# EAGLE design DIN3X (EAGLE 5.06)
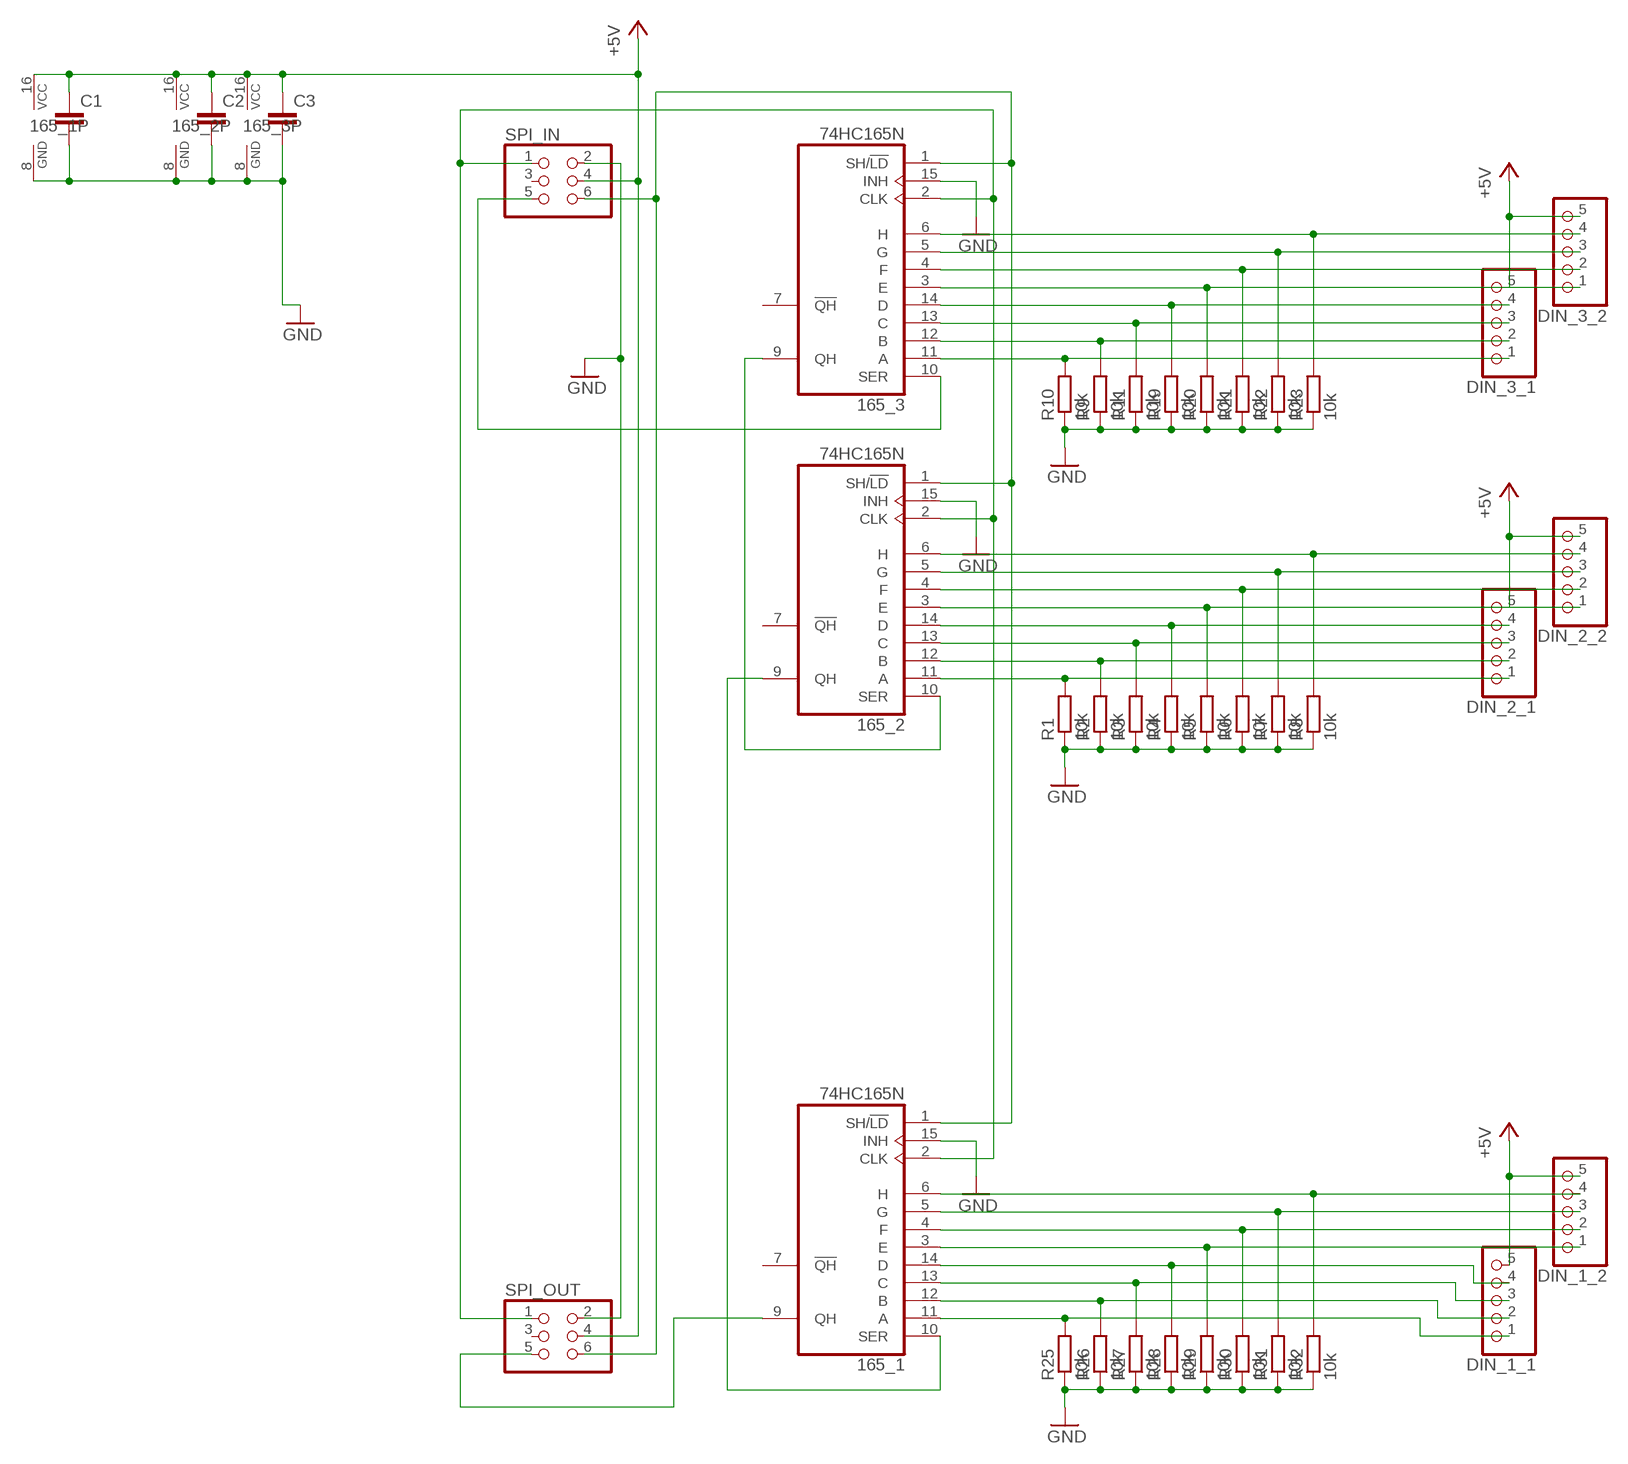
[diagram p0: schematic, sheet 1]

## Parts
165_1  74HC165N  [DIL16]
165_2  74HC165N  [DIL16]
165_3  74HC165N  [DIL16]
C1  C-EU050-024X044  [C050-024X044]
C2  C-EU050-024X044  [C050-024X044]
C3  C-EU050-024X044  [C050-024X044]
DIN_1_1  PINHD-1X5  [1X05]
DIN_1_2  PINHD-1X5  [1X05]
DIN_2_1  PINHD-1X5  [1X05]
DIN_2_2  PINHD-1X5  [1X05]
DIN_3_1  PINHD-1X5  [1X05]
DIN_3_2  PINHD-1X5  [1X05]
R1  10k  R-EU_0207/10  [0207/10]
R2  10k  R-EU_0207/10  [0207/10]
R3  10k  R-EU_0207/10  [0207/10]
R4  10k  R-EU_0207/10  [0207/10]
R5  10k  R-EU_0207/10  [0207/10]
R6  10k  R-EU_0207/10  [0207/10]
R7  10k  R-EU_0207/10  [0207/10]
R8  10k  R-EU_0207/10  [0207/10]
R9  10k  R-EU_0207/10  [0207/10]
R10  10k  R-EU_0207/10  [0207/10]
R11  10k  R-EU_0207/10  [0207/10]
R19  10k  R-EU_0207/10  [0207/10]
R20  10k  R-EU_0207/10  [0207/10]
R21  10k  R-EU_0207/10  [0207/10]
R22  10k  R-EU_0207/10  [0207/10]
R23  10k  R-EU_0207/10  [0207/10]
R25  10k  R-EU_0207/10  [0207/10]
R26  10k  R-EU_0207/10  [0207/10]
R27  10k  R-EU_0207/10  [0207/10]
R28  10k  R-EU_0207/10  [0207/10]
R29  10k  R-EU_0207/10  [0207/10]
R30  10k  R-EU_0207/10  [0207/10]
R31  10k  R-EU_0207/10  [0207/10]
R32  10k  R-EU_0207/10  [0207/10]
SPI_IN  PINHD-2X3  [2X03]
SPI_OUT  PINHD-2X3  [2X03]

## Nets
+5V: 165_1.16(VCC) 165_2.16(VCC) 165_3.16(VCC) C1.1 C2.1 C3.1 DIN_1_1.5 DIN_1_2.5 DIN_2_1.5 DIN_2_2.5 DIN_3_1.5 DIN_3_2.5 SPI_IN.4 SPI_OUT.4
D0: 165_3.11(A) DIN_3_1.1 R10.2
D1: 165_3.12(B) DIN_3_1.2 R9.2
D2: 165_3.13(C) DIN_3_1.3 R11.2
D3: 165_3.14(D) DIN_3_1.4 R19.2
D4: 165_3.3(E) DIN_3_2.1 R20.2
D5: 165_3.4(F) DIN_3_2.2 R21.2
D6: 165_3.5(G) DIN_3_2.3 R22.2
D7: 165_3.6(H) DIN_3_2.4 R23.2
D8: 165_2.6(H) DIN_2_2.4 R8.2
D9: 165_2.5(G) DIN_2_2.3 R7.2
D10: 165_2.4(F) DIN_2_2.2 R6.2
D11: 165_2.3(E) DIN_2_2.1 R5.2
D12: 165_2.14(D) DIN_2_1.4 R4.2
D13: 165_2.13(C) DIN_2_1.3 R3.2
D14: 165_2.12(B) DIN_2_1.2 R2.2
D15: 165_2.11(A) DIN_2_1.1 R1.2
D24: 165_1.6(H) DIN_1_2.4 R32.2
D25: 165_1.5(G) DIN_1_2.3 R31.2
D26: 165_1.4(F) DIN_1_2.2 R30.2
D27: 165_1.3(E) DIN_1_2.1 R29.2
D28: 165_1.14(D) DIN_1_1.4 R28.2
D29: 165_1.13(C) DIN_1_1.3 R27.2
D30: 165_1.12(B) DIN_1_1.2 R26.2
D31: 165_1.11(A) DIN_1_1.1 R25.2
GND: 165_1.8(GND) 165_1.15(INH) 165_2.8(GND) 165_2.15(INH) 165_3.8(GND) 165_3.15(INH) C1.2 C2.2 C3.2 R1.1 R2.1 R3.1 R4.1 R5.1 R6.1 R7.1 R8.1 R9.1 R10.1 R11.1 R19.1 R20.1 R21.1 R22.1 R23.1 R25.1 R26.1 R27.1 R28.1 R29.1 R30.1 R31.1 R32.1 SPI_IN.2 SPI_OUT.2
N$3: 165_1.10(SER) 165_2.9(QH)
N$4: 165_3.10(SER) SPI_IN.5
N$5: 165_1.9(QH) SPI_OUT.5
N$30: 165_1.1(SH/!LD) 165_2.1(SH/!LD) 165_3.1(SH/!LD) SPI_IN.6 SPI_OUT.6
N$33: 165_2.10(SER) 165_3.9(QH)
N$82: 165_1.2(CLK) 165_2.2(CLK) 165_3.2(CLK) SPI_IN.1 SPI_OUT.1
Unconnected: 165_1.7(!QH) 165_2.7(!QH) 165_3.7(!QH) SPI_IN.3 SPI_OUT.3

## Library data of the parts
165_1-165_3 = 74xx-eu:74*165: 8-bit parallel load SHIFT REGISTER
C1-C3 = rcl:C-EU: CAPACITOR, European symbol
DIN_1_1 DIN_1_2 DIN_2_1 DIN_2_2 DIN_3_1 DIN_3_2 = pinhead:PINHD-1X5: PIN HEADER
R1-R11 R19-R23 R25-R32 = rcl:R-EU_: RESISTOR, European symbol
SPI_IN SPI_OUT = pinhead:PINHD-2X3: PIN HEADER

## Board
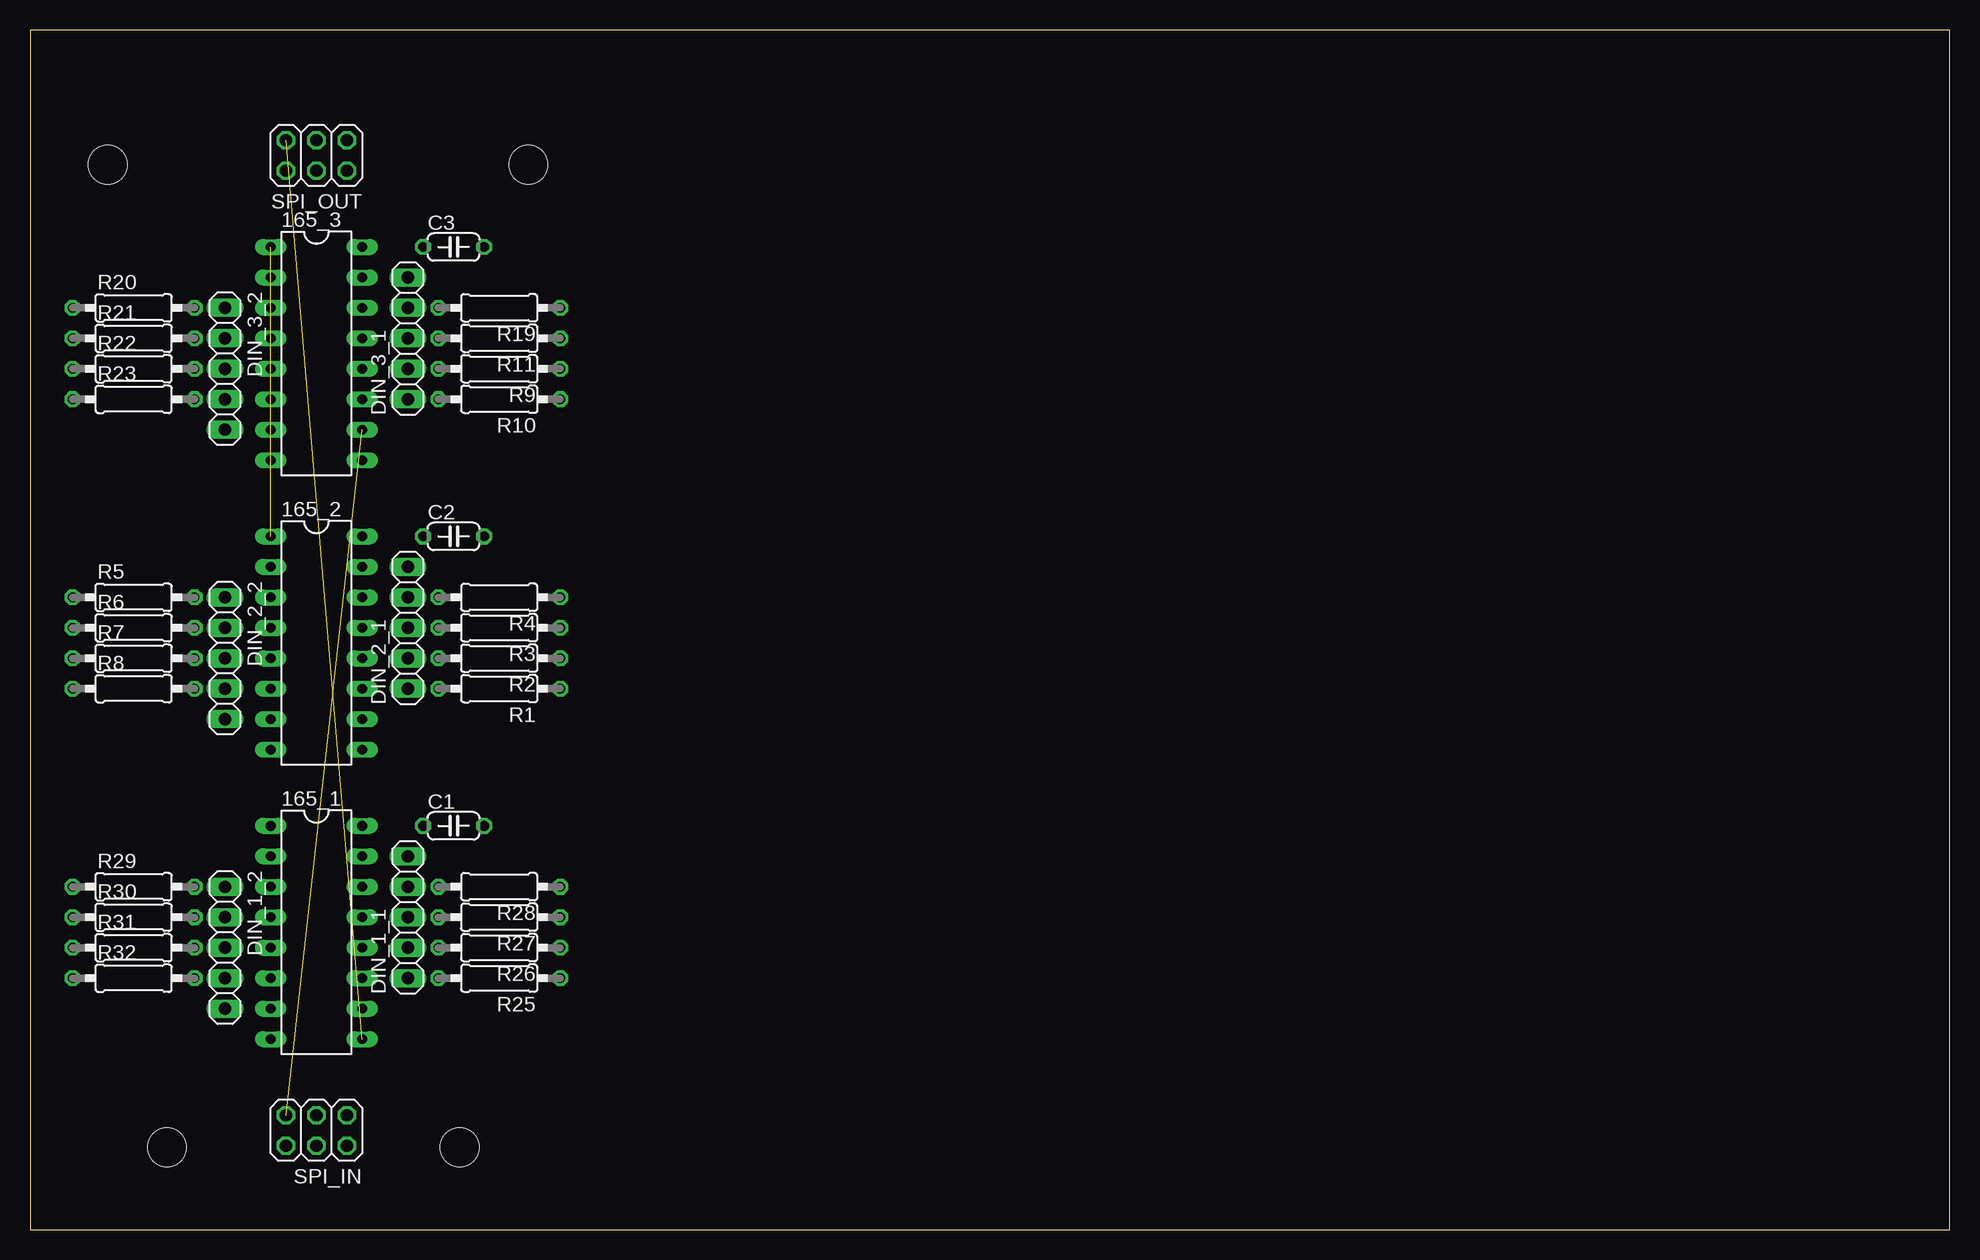
[diagram p1: board, top side]
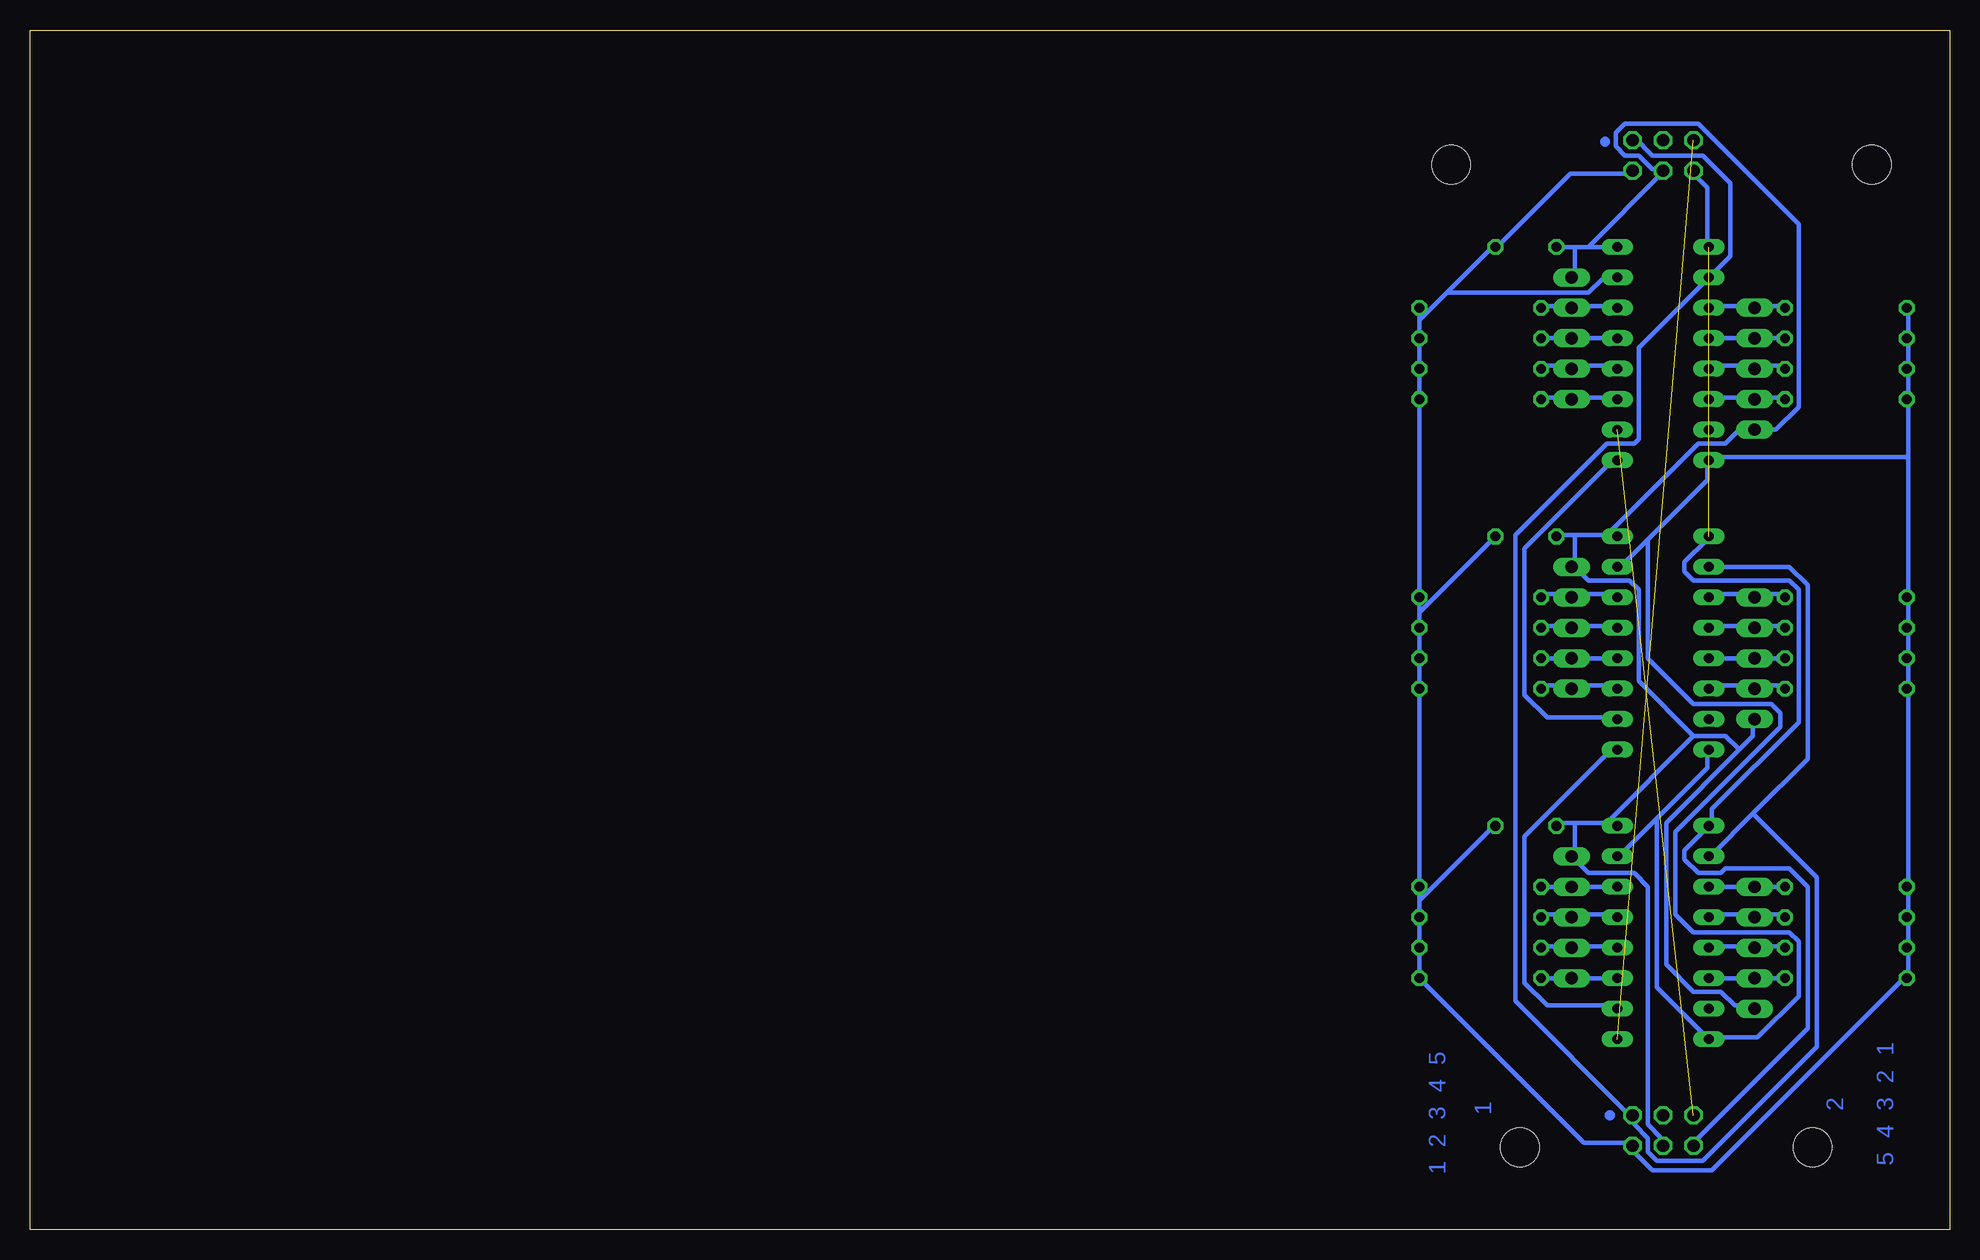
[diagram p2: board, bottom side, seen from below]

Size 160 x 100 mm. Coordinates in mm from the lower left corner, seen from the top.
Outline: 0,0 160,0 160,100 0,100 0,0
Copper layers (1*16): Top 0.018mm / dielectric 1.5mm / Bottom 0.018mm
Design rules "DRC": minimum track width 15mil, minimum drill 20mil, track to track 10mil, track to pad 10mil, pad to pad 10mil, via to via 10mil, smd to smd 8mil, copper to edge 80mil, drill to drill 20mil, minimum pad ring 10mil, minimum via ring 10mil, stop-mask expansion 4mil, vias tented up to drill 0mil, thermal gap 10mil
Holes 3.2 mm at 11.43,6.86 35.81,6.86 41.53,88.77 6.48,88.77

### Footprints (pad centres in the part's own frame; a part is rotated, then mirrored left to right if it is on the bottom)
DIL16 = drill 0.813 long: 1 -8.89,-3.81; 2 -6.35,-3.81; 3 -3.81,-3.81; 4 -1.27,-3.81; 5 1.27,-3.81; 6 3.81,-3.81; 7 6.35,-3.81; 8 8.89,-3.81; 9 8.89,3.81; 10 6.35,3.81; 11 3.81,3.81; 12 1.27,3.81; 13 -1.27,3.81; 14 -3.81,3.81; 15 -6.35,3.81; 16 -8.89,3.81
C050-024X044 = drill 0.813 octagon: 1 -2.54,0; 2 2.54,0
1X05 = drill 1.016 long: 1 -5.08,0; 2 -2.54,0; 3 0,0; 4 2.54,0; 5 5.08,0
0207/10 = drill 0.813 octagon: 1 -5.08,0; 2 5.08,0
2X03 = drill 1.016 octagon: 1 -2.54,-1.27; 2 -2.54,1.27; 3 0,-1.27; 4 0,1.27; 5 2.54,-1.27; 6 2.54,1.27

### Placement (x,y rotation side)
165_1  23.88,24.77 270 top
165_2  23.88,48.9 270 top
165_3  23.88,73.03 270 top
C1  35.31,33.66 0 top
C2  35.31,57.78 0 top
C3  35.31,81.92 0 top
DIN_1_1  31.5,26.04 90 top
DIN_1_2  16.26,23.5 270 top
DIN_2_1  31.5,50.16 90 top
DIN_2_2  16.26,47.62 270 top
DIN_3_1  31.5,74.3 90 top
DIN_3_2  16.26,71.75 270 top
R1  39.12,45.09 180 top
R2  39.12,47.62 180 top
R3  39.12,50.16 180 top
R4  39.12,52.7 180 top
R5  8.64,52.7 0 top
R6  8.64,50.16 0 top
R7  8.64,47.62 0 top
R8  8.64,45.09 0 top
R9  39.12,71.75 180 top
R10  39.12,69.22 180 top
R11  39.12,74.3 180 top
R19  39.12,76.83 180 top
R20  8.64,76.83 0 top
R21  8.64,74.3 0 top
R22  8.64,71.75 0 top
R23  8.64,69.22 0 top
R25  39.12,20.95 180 top
R26  39.12,23.5 180 top
R27  39.12,26.04 180 top
R28  39.12,28.57 180 top
R29  8.64,28.57 0 top
R30  8.64,26.04 0 top
R31  8.64,23.5 0 top
R32  8.64,20.95 0 top
SPI_IN  23.88,8.26 180 top
SPI_OUT  23.88,89.53 180 top

### Tracks (layer width: path | path; a pad name or v marks a point on that pad's centre or on a via)
+5V
  Bottom 0.381: 17.53,40.01 16.38,41.15 16.38,42.29 DIN_2_2.5 | 17.53,40.01 23.62,33.91 23.62,22.1 21.34,19.81 19.05,19.81 17.91,18.67 16.38,18.67 DIN_1_2.5 | 28.57,33.91 27.81,33.91 165_1.16 28.57,33.91 | 31.24,33.91 28.57,33.91 | 31.24,33.91 32.77,33.91 C1.1 | 31.24,33.91 31.24,31.24 DIN_1_1.5 30.1,29.72 26.29,29.72 25.15,28.57 25.15,8.76 24,7.62 24,7.24 SPI_IN.4 | 17.53,40.01 18.67,41.15 21.34,41.15 | 28.57,33.91 21.34,41.15 | 30.1,81.92 31.24,81.92 | 31.24,81.92 C3.1 | 30.1,81.92 165_3.16 | 31.24,81.92 31.24,79.63 DIN_3_1.5 | 30.1,81.92 24,88.01 SPI_OUT.4 24,88.39 24.77,88.39 25.91,89.53 27.05,89.53 27.81,90.3 27.81,91.44 27.05,92.2 20.95,92.2 12.57,83.82 12.57,68.58 14.48,66.67 DIN_3_2.5 17.53,66.67 18.67,65.53 20.95,65.53 28.57,57.91 | 28.57,57.91 27.81,57.91 165_2.16 28.57,57.91 | 31.24,57.91 28.57,57.91 | 31.24,57.91 32.77,57.91 C2.1 | 31.24,55.24 31.24,57.91 | 21.34,41.15 25.91,45.72 25.91,53.34 26.67,54.1 30.1,54.1 31.24,55.24 | 31.24,55.24 DIN_2_1.5
D0
  Bottom 0.381: R10.2 33.91,69.34 31.62,69.34 DIN_3_1.1 31.24,69.34 27.81,69.34 165_3.11
D1
  Bottom 0.381: R9.2 33.91,72.01 31.62,72.01 DIN_3_1.2 31.24,72.01 27.81,72.01 165_3.12
D2
  Bottom 0.381: R11.2 DIN_3_1.3 165_3.13
D3
  Bottom 0.381: R19.2 33.91,76.96 31.62,76.96 DIN_3_1.4 31.24,76.96 27.81,76.96 165_3.14
D4
  Bottom 0.381: 165_3.3 19.81,76.96 16.38,76.96 DIN_3_2.1 16,76.96 13.72,76.96 R20.2
D5
  Bottom 0.381: 165_3.4 DIN_3_2.2 R21.2
D6
  Bottom 0.381: 165_3.5 19.81,72.01 16.38,72.01 DIN_3_2.3 16,72.01 13.72,72.01 R22.2
D7
  Bottom 0.381: 165_3.6 19.81,69.34 16.38,69.34 DIN_3_2.4 16,69.34 13.72,69.34 R23.2
D8
  Bottom 0.381: 165_2.6 19.81,45.34 16.38,45.34 DIN_2_2.4 16,45.34 13.72,45.34 R8.2
D9
  Bottom 0.381: 165_2.5 DIN_2_2.3 R7.2
D10
  Bottom 0.381: 165_2.4 19.81,50.29 16.38,50.29 DIN_2_2.2 16,50.29 13.72,50.29 R6.2
D11
  Bottom 0.381: 165_2.3 19.81,52.96 16.38,52.96 DIN_2_2.1 16,52.96 13.72,52.96 R5.2
D12
  Bottom 0.381: R4.2 33.91,52.96 31.62,52.96 DIN_2_1.4 31.24,52.96 27.81,52.96 165_2.14
D13
  Bottom 0.381: R3.2 33.91,50.29 31.62,50.29 DIN_2_1.3 31.24,50.29 27.81,50.29 165_2.13
D14
  Bottom 0.381: R2.2 DIN_2_1.2 165_2.12
D15
  Bottom 0.381: R1.2 33.91,45.34 31.62,45.34 DIN_2_1.1 31.24,45.34 27.81,45.34 165_2.11
D24
  Bottom 0.381: 165_1.6 DIN_1_2.4 R32.2
D25
  Bottom 0.381: 165_1.5 19.81,23.62 16.38,23.62 DIN_1_2.3 16,23.62 13.72,23.62 R31.2
D26
  Bottom 0.381: 165_1.4 19.81,26.29 16.38,26.29 DIN_1_2.2 16,26.29 13.72,26.29 R30.2
D27
  Bottom 0.381: 165_1.3 DIN_1_2.1 R29.2
D28
  Bottom 0.381: R28.2 DIN_1_1.4 165_1.14
D29
  Bottom 0.381: R27.2 33.91,26.29 31.62,26.29 DIN_1_1.3 31.24,26.29 27.81,26.29 165_1.13
D30
  Bottom 0.381: R26.2 33.91,23.62 31.62,23.62 DIN_1_1.2 31.24,23.62 27.81,23.62 165_1.12
D31
  Bottom 0.381: R25.2 DIN_1_1.1 165_1.11
GND
  Bottom 0.381: 24.38,34.29 20.19,38.48 20.19,40.01 165_2.8 | 24.38,34.29 27.43,31.24 165_1.15 | 24.38,34.29 24.38,20.19 165_1.8 19.81,16 16,16 12.57,19.43 12.57,24 13.34,24.77 21.34,24.77 22.86,26.29 22.86,33.15 14.1,41.91 14.1,43.05 14.86,43.81 21.34,43.81 25.15,47.62 25.15,57.53 | 25.15,57.53 20.19,62.48 20.19,64.01 165_3.8 19.81,64.39 3.43,64.39 | 25.15,57.53 27.43,55.24 165_2.15 | 3.43,74.3 3.43,72.01 R22.1 3.43,71.63 3.43,69.34 R23.1 3.43,68.96 3.43,64.39 | 3.43,74.3 3.43,76.58 R20.1 | 3.43,74.3 R21.1 | 3.43,28.57 3.43,26.29 R30.1 3.43,25.91 3.43,23.62 R31.1 3.43,23.24 3.43,20.95 R32.1 3.81,20.95 19.81,4.95 24.77,4.95 26.67,6.86 SPI_IN.2 26.67,7.24 30.48,7.24 R25.1 R26.1 R27.1 44.2,27.43 | 3.43,47.62 3.43,45.34 R8.1 3.43,44.96 3.43,28.57 | 3.43,47.62 3.43,49.91 R6.1 3.43,50.29 3.43,52.58 R5.1 3.43,52.96 3.43,64.39 | 3.43,47.62 R7.1 | 3.43,28.57 R29.1 | 44.2,75.82 R11.1 R9.1 R10.1 R4.1 44.2,51.44 | 44.2,75.82 R19.1 | 44.2,75.82 41.91,78.11 | 41.91,78.11 38.1,81.92 C3.2 37.72,81.92 31.62,88.01 26.67,88.01 SPI_OUT.2 | 41.91,78.11 30.1,78.11 28.96,79.25 27.81,79.25 165_3.15 | 44.2,51.44 R3.1 R2.1 R1.1 R28.1 44.2,27.43 | 44.2,51.44 C2.2 | 44.2,27.43 38.1,33.53 C1.2
N$3
  Bottom 0.381: 165_1.10 27.81,18.67 33.53,18.67 35.43,20.57 35.43,32.77 28.19,40.01 165_2.9
N$4  (1 unrouted)
N$5  (1 unrouted)
N$30  (1 unrouted)
  Bottom 0.381: 165_2.1 20.19,57.53 22.1,55.63 22.1,54.86 21.34,54.1 13.34,54.1 12.57,53.34 12.57,42.29 19.81,35.05 19.81,33.91 165_1.1 22.1,31.62 22.1,30.86 20.95,29.72 19.05,29.72 18.67,30.1 13.34,30.1 11.81,28.57 11.81,16.76 21.34,7.24 SPI_IN.6 | 165_3.1 20.19,81.92 20.19,86.87 21.34,88.01 SPI_OUT.6
N$33
  Bottom 0.381: 165_2.10 27.81,42.67 33.53,42.67 35.43,44.58 35.43,56.77 27.81,64.39 165_3.9
N$82
  Bottom 0.381: SPI_OUT.1 26.29,91.06 24.77,89.53 20.57,89.53 18.29,87.25 18.29,81.15 165_3.2 25.91,73.53 25.91,65.91 26.29,65.53 28.57,65.53 36.2,57.91 36.2,19.05 26.67,9.53 SPI_IN.1 26.29,9.53 26.29,8.76 25.15,7.62 25.15,6.48 24.38,5.71 20.57,5.71 11.05,15.24 11.05,29.34 16.38,34.67 | 16.38,34.67 11.81,39.24 11.81,53.72 13.34,55.24 165_2.2 | 16.38,34.67 19.81,31.24 165_1.2
(copper drawn outside any net)
  shapes: Bottom circle x2

### Text on the board
Bottom: 1 | 5 | 2 | 4 | 3 | 2 | 1 | 3 | 4 | 2 | 5 | 1